# Altium schematic sheet CATS-Vega-Storage.SchDoc: CATS Vega
size A4; DocumentNumber: Overview; Revision: V1.0; SheetNumber: 8; SheetTotal: 16; Author: Luca Jost; Subtitle: Storage
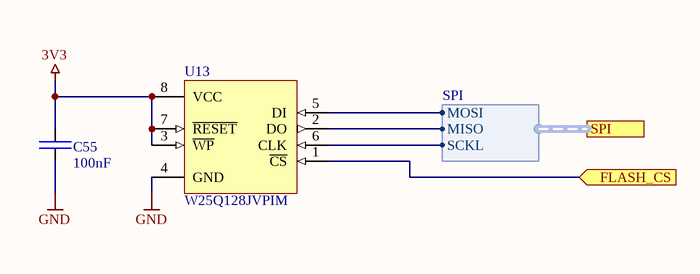
[diagram p0: CATS-Vega-Storage.SchDoc]

## Parts
C55  100nF  [SMD Keramikkondensator 0603]
U13  W25Q128JVPIM  [SMD IC WSON-8 (6x5)]

## Ports
FLASH_CS (in), SPI (harness SPI)

## Harnesses
SPI: SCKL, MOSI, MISO

## Nets
3V3: C55.2 U13.3(~{WP}) U13.7(~{RESET}) U13.8(VCC)
GND: C55.1 U13.4(GND)
FLASH_CS: U13.1(~{CS}) ; port FLASH_CS
NetU13_2: U13.2(DO) ; port SPI.MISO
NetU13_5: U13.5(DI) ; port SPI.MOSI
NetU13_6: U13.6(CLK) ; port SPI.SCKL

## Notes on the sheet
- Title
- Author:
- Subtitle
- Date:
- Rev:
- File:
- Sheet
- of

## Library data of the parts
C55 = E6 - 100nF: SMD Ceramic Capacitor E6; Unit Price: 0.0024; JLC: C1591
U13 = W25Q128JVPIM: 3V 128M-BIT / SERIAL FLASH MEMORY WITH / DUAL/QUAD SPI & QPI & DTR; ComponentLink1Description: Datasheet; ComponentLink1URL: https://www.winbond.com/resource-files/w25q128jv_dtr%20revc%2003272018%20plus.pdf; Digikey: W25Q128JVPIM-ND; JLC: C190862; Unit Price: 0.8798